# Altium schematic sheet BluetoothToPhone.SchDoc
size B
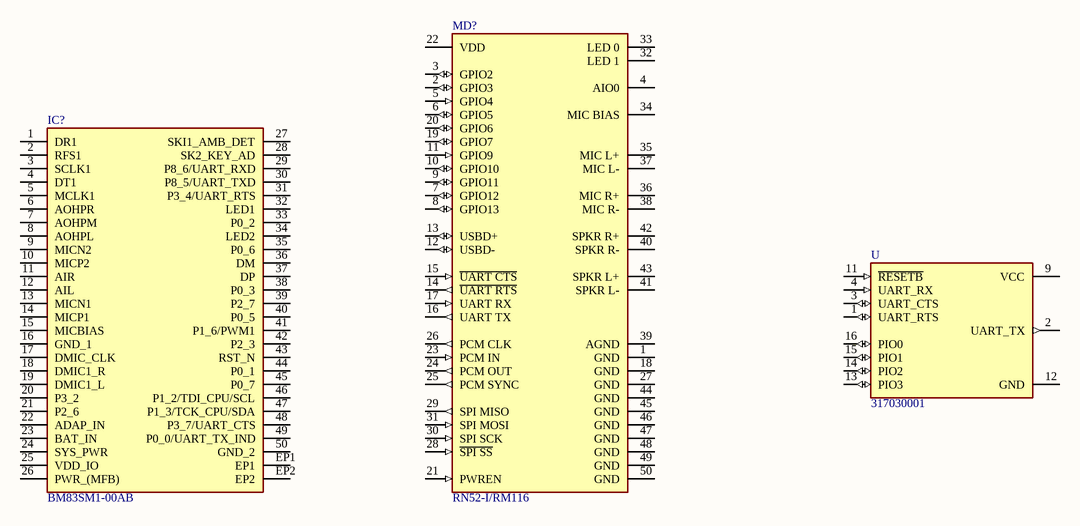
[diagram p0: BluetoothToPhone.SchDoc]

## Parts
IC?  BM83SM1-00AB  [BM83SM100AA]
MD?  RN52-I/RM116  [FP-RN52-I-RM116-MFG]
U  317030001  [XCVR_317030001]

## Nets

Not connected (* = marked no-connect by the designer): IC? 1(DR1) 2(RFS1) 3(SCLK1) 4(DT1) 5(MCLK1) 6(AOHPR) 7(AOHPM) 8(AOHPL) 9(MICN2) 10(MICP2) 11(AIR) 12(AIL) 13(MICN1) 14(MICP1) 15(MICBIAS) 16(GND_1) 17(DMIC_CLK) 18(DMIC1_R) 19(DMIC1_L) 20(P3_2) 21(P2_6) 22(ADAP_IN) 23(BAT_IN) 24(SYS_PWR) 25(VDD_IO) 26(PWR_(MFB)) 27(SKI1_AMB_DET) 28(SK2_KEY_AD) 29(P8_6/UART_RXD) 30(P8_5/UART_TXD) 31(P3_4/UART_RTS) 32(LED1) 33(P0_2) 34(LED2) 35(P0_6) 36(DM) 37(DP) 38(P0_3) 39(P2_7) 40(P0_5) 41(P1_6/PWM1) 42(P2_3) 43(RST_N) 44(P0_1) 45(P0_7) 46(P1_2/TDI_CPU/SCL) 47(P1_3/TCK_CPU/SDA) 48(P3_7/UART_CTS) 49(P0_0/UART_TX_IND) 50(GND_2) EP1 EP2; MD? 1(GND) 2(GPIO3) 3(GPIO2) 4(AIO0) 5(GPIO4) 6(GPIO5) 7(GPIO12) 8(GPIO13) 9(GPIO11) 10(GPIO10) 11(GPIO9) 12(USBD-) 13(USBD+) 14(~{UART_RTS}) 15(~{UART_CTS}) 16(UART_TX) 17(UART_RX) 18(GND) 19(GPIO7) 20(GPIO6) 21(PWREN) 22(VDD) 23(PCM_IN) 24(PCM_OUT) 25(PCM_SYNC) 26(PCM_CLK) 27(GND) 28(~{SPI_SS}) 29(SPI_MISO) 30(SPI_SCK) 31(SPI_MOSI) 32(LED_1) 33(LED_0) 34(MIC_BIAS) 35(MIC_L+) 36(MIC_R+) 37(MIC_L-) 38(MIC_R-) 39(AGND) 40(SPKR_R-) 41(SPKR_L-) 42(SPKR_R+) 43(SPKR_L+) 44(GND) 45(GND) 46(GND) 47(GND) 48(GND) 49(GND) 50(GND); U 1(UART_RTS) 2(UART_TX) 3(UART_CTS) 4(UART_RX) 9(VCC) 11(~{RESETB}) 12(GND) 13(PIO3) 14(PIO2) 15(PIO1) 16(PIO0)

## Notes on the sheet
- Title
- Size:
- Date:
- B
- Number:
- Time:
- Revision:
- Sheet
- of
- File:

## Library data of the parts
IC? = BM83SM1-00AB: Integrated Circuit; Manufacturer_Name: Microchip; Datasheet Link: http://ww1.microchip.com/downloads/en/DeviceDoc/BM83_Bluetooth_Stereo_Audio_Module_Data_Sheet_DS70005402A.pdf; Height: 2.5mm; Manufacturer_Part_Number: BM83SM1-00AB; Mouser Part Number: 579-BM83SM1-00AB; Mouser Price/Stock: https://www.mouser.co.uk/ProductDetail/Microchip-Technology/BM83SM1-00AB?qs=W%2FMpXkg%252BdQ4%2FPurIjXhtZA%3D%3D; Arrow Part Number: BM83SM1-00AB; Arrow Price/Stock: https://www.arrow.com/en/products/bm83sm1-00ab/microchip-technology
MD? = CMP-06331-000013-1: RF TXRX MOD BLUETOOTH TRACE ANT; Manufacturer: Microchip; Bandwidth: 80MHz; Min Supply Voltage: 3V; Data Rate: 3Mbits/s; Sensitivity: -85dBm; Max Supply Voltage: 3.6V; Number Of Gpio: 11; Number Of Adc Channels: 2; Max Frequency: 2.48GHz; Interface: SPI,UART,USB,I2S,Other; Mouser Description: Bluetooth 3.0 class 2 surface mount audio module with PCB trace antenna; Device Class L2: RF Semiconductors and Devices; Height: 2.8mm; Manufacturer Part Number: RN52-I/RM116; Device Class L1: Integrated Circuits (ICs); Temperature Range High: +85°C; RoHS: TRUE; Category: UNK; Octopart: https://octopart.com/rn52-i%2Frm116-microchip-47106603; Lead Free: Yes; ComponentLink2URL: http://www.microchip.com/mymicrochip/filehandler.aspx?ddocname=en560769; Automotive: No; Temperature Range Low: -40°C; Package: 0; Digikey Description: RF TXRX MOD BLUETOOTH TRACE ANT; Temperature: -40°C to +85°C; ComponentLink2Description: Datasheet; Device Class L3: Transceivers
U = 317030001: Bluetooth Bluetooth v4.0 Transceiver Module 2.4GHz Integrated, Trace Surface Mount; MF: Seeed Technology; Value: *; SnapEDA_Link: https://www.snapeda.com/parts/317030001/Seeed%20Technology%20Co.%2C%20Ltd/view-part/449174/?ref=snap; Digi-Key_Purchase_URL: https://www.digikey.kr/product-detail/en/seeed-technology-co-ltd/317030001/1597-1359-ND/5487659?utm_source=snapeda&utm_medium=aggregator&utm_campaign=symbol; MP: 317030001; Digi-Key_Part_Number: 1597-1359-ND; Package: Module Seeed Technology